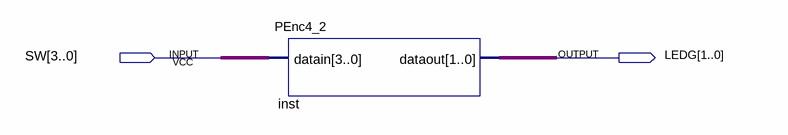
[diagram p0: schematic sheet]
// Quartus schematic PEnc4_2Demo.bdf as structural Verilog: 1 symbols, 2 pins
module PEnc4_2Demo (
  input  [3:0] SW,
  output [1:0] LEDG
);

  PEnc4_2 inst (.datain(SW), .dataout(LEDG));
endmodule
